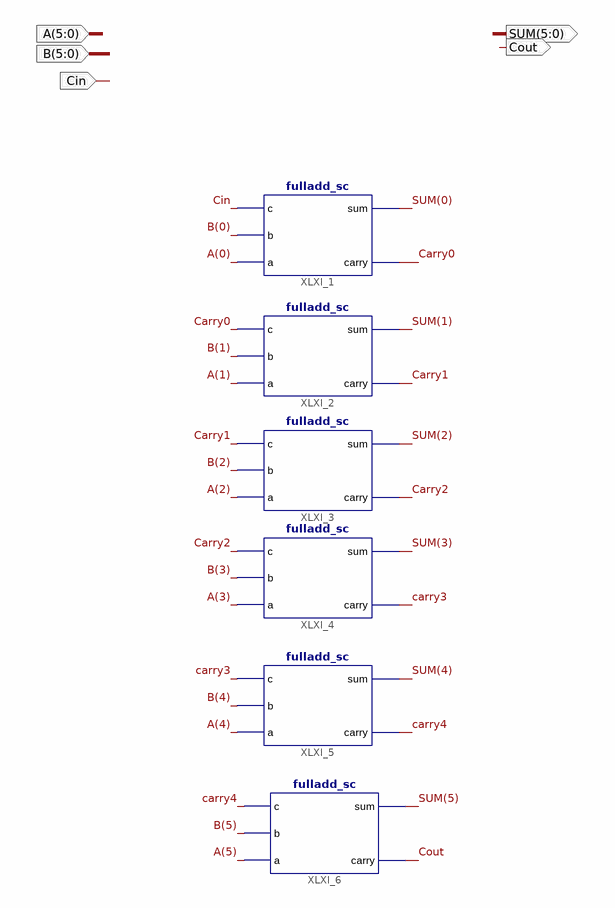
[diagram p0: schematic sheet 1]
// Xilinx ISE schematic fa_6bit_sc.sch (spartan6) as structural Verilog: 6 symbols, 5 ports
module fa_6bit_sc (
  input  [5:0] A,
  input  [5:0] B,
  input  Cin,
  output Cout,
  output [5:0] SUM
);

  wire Carry0, Carry1, Carry2, carry3, carry4;

  fulladd_sc XLXI_1 (.c(Cin), .b(B[0]), .a(A[0]), .sum(SUM[0]), .carry(Carry0));
  fulladd_sc XLXI_2 (.c(Carry0), .b(B[1]), .a(A[1]), .sum(SUM[1]), .carry(Carry1));
  fulladd_sc XLXI_3 (.c(Carry1), .b(B[2]), .a(A[2]), .sum(SUM[2]), .carry(Carry2));
  fulladd_sc XLXI_4 (.c(Carry2), .b(B[3]), .a(A[3]), .sum(SUM[3]), .carry(carry3));
  fulladd_sc XLXI_5 (.c(carry3), .b(B[4]), .a(A[4]), .sum(SUM[4]), .carry(carry4));
  fulladd_sc XLXI_6 (.c(carry4), .b(B[5]), .a(A[5]), .sum(SUM[5]), .carry(Cout));
endmodule
